# Altium schematic sheet RPi.SchDoc
size A
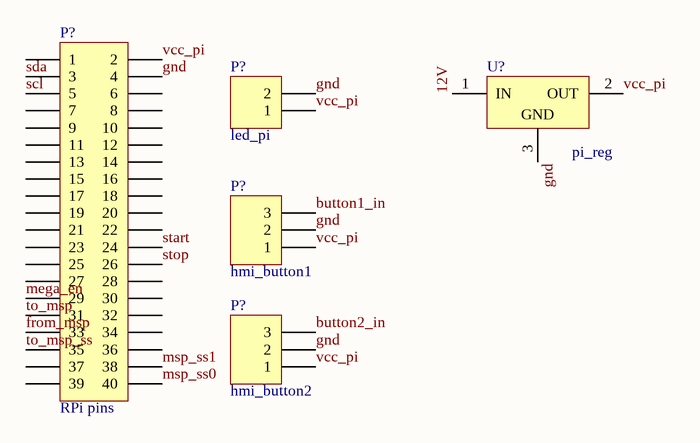
[diagram p0: RPi.SchDoc]

## Parts
(Parts that share a designator on the sheet are numbered #1, #2 ... from top to bottom, then left to right.)
P?#1  RPi pins  [HDR2X20]
P?#2  led_pi  [HDR1X2H]
P?#3  hmi_button1  [HDR1X3H]
P?#4  hmi_button2  [HDR1X3H]
U?  pi_reg  [TO220ABN]

## Nets
12V: U?.1(IN)
button1_in: P?#3.3
button2_in: P?#4.3
from_msp: P?#1.33
gnd: P?#1.4 P?#2.2 P?#3.2 P?#4.2 U?.3(GND)
mega_en: P?#1.29
msp_ss0: P?#1.40
msp_ss1: P?#1.38
scl: P?#1.5
sda: P?#1.3
start: P?#1.24
stop: P?#1.26
to_msp: P?#1.31
to_msp_ss: P?#1.35
vcc_pi: P?#1.2 P?#2.1 P?#3.1 P?#4.1 U?.2(OUT)

Not connected (* = marked no-connect by the designer): P?#1 1 6 7 8 9 10 11 12 13 14 15 16 17 18 19 20 21 22 23 25 27 28 30 32 34 36 37 39

## Library data of the parts
P?#1 = Header 20X2: Header, 20-Pin, Dual row; LatestRevisionDate: 17-Jul-2002; LatestRevisionNote: Re-released for DXP Platform.; Publisher: Altium Limited
P?#2 = Header 2H: Header, 2-Pin, Right Angle; LatestRevisionDate: 17-Jul-2002; LatestRevisionNote: Re-released for DXP Platform.; Publisher: Altium Limited
P?#3 P?#4 = Header 3H: Header, 3-Pin, Right Angle; LatestRevisionDate: 17-Jul-2002; LatestRevisionNote: Re-released for DXP Platform.; Publisher: Altium Limited
U? = L7805CV: Positive Voltage Regulator; Note: Tab is connected to pin 3 (GND).; Published: 24-Aug-2001; LatestRevisionDate: 17-Jul-2002; LatestRevisionNote: Re-released for DXP Platform.; DatasheetVersion: Dec-1998; PackageVersion: Jun-1998; PackageReference: TO220ABN; Publisher: Altium Limited; PackageDescription: TO, Thru-Hole, Vertical, Heatsink Mounted; 3 In-Line Leads; Pitch 2.54 mm; Pin sequence 1, 3, 2; ComponentLink1Description: Manufacturer Link; ComponentLink1URL: http://www.st.com/